# Altium project LPF-8-Order.PrjPcb
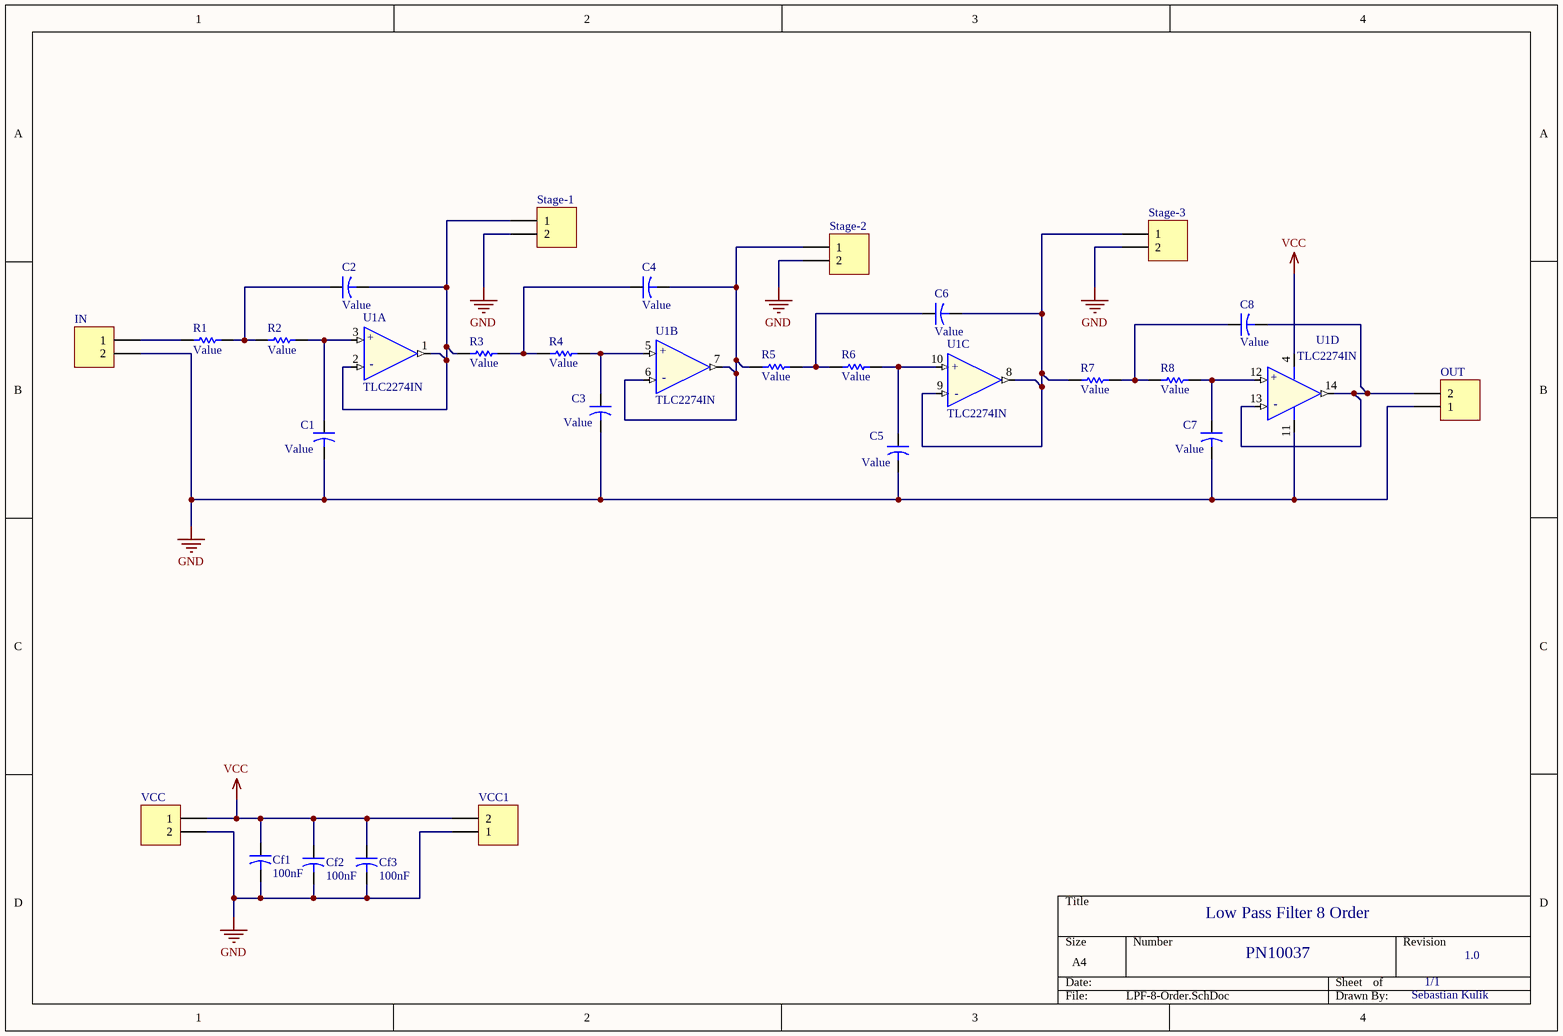
[diagram p0: LPF-8-Order.SchDoc]
1 sheet, 27 parts. Net scope: global (net labels, ports and power ports of the same name join across sheets).
Board file: LPF-8-Order.PcbDoc

## Sheet LPF-8-Order.SchDoc
size A4

### Parts
C1  Capacitor-Dummy-THT  [Dummy-10mm]  (value not drawn)
C2  Capacitor-Dummy-THT  [Dummy-10mm]  (value not drawn)
C3  Capacitor-Dummy-THT  [Dummy-10mm]  (value not drawn)
C4  Capacitor-Dummy-THT  [Dummy-10mm]  (value not drawn)
C5  Capacitor-Dummy-THT  [Dummy-10mm]  (value not drawn)
C6  Capacitor-Dummy-THT  [Dummy-10mm]  (value not drawn)
C7  Capacitor-Dummy-THT  [Dummy-10mm]  (value not drawn)
C8  Capacitor-Dummy-THT  [Dummy-10mm]  (value not drawn)
Cf1  value 100nF  [Dummy-10mm]  (hidden comment: Capacitor-Dummy-THT)
Cf2  value 100nF  [Dummy-10mm]  (hidden comment: Capacitor-Dummy-THT)
Cf3  value 100nF  [Dummy-10mm]  (hidden comment: Capacitor-Dummy-THT)
IN  PHOENIX_1715721  [Phoenix-2-5_08]  (value not drawn)
OUT  PHOENIX_1715721  [Phoenix-2-5_08]  (value not drawn)
R1  Resistor-Dummy-THT  [Dummy-10mm]  (value not drawn)
R2  Resistor-Dummy-THT  [Dummy-10mm]  (value not drawn)
R3  Resistor-Dummy-THT  [Dummy-10mm]  (value not drawn)
R4  Resistor-Dummy-THT  [Dummy-10mm]  (value not drawn)
R5  Resistor-Dummy-THT  [Dummy-10mm]  (value not drawn)
R6  Resistor-Dummy-THT  [Dummy-10mm]  (value not drawn)
R7  Resistor-Dummy-THT  [Dummy-10mm]  (value not drawn)
R8  Resistor-Dummy-THT  [Dummy-10mm]  (value not drawn)
Stage-1  Plug_2_90_2.54  [HDR1X2]  (value not drawn)
Stage-2  Plug_2_90_2.54  [HDR1X2]  (value not drawn)
Stage-3  Plug_2_90_2.54  [HDR1X2]  (value not drawn)
U1  TLC2274IN  [DIP-14]  (parts A,B,C,D of 4)
VCC  PHOENIX_1715721  [Phoenix-2-5_08]  (value not drawn)
VCC1  PHOENIX_1715721  [Phoenix-2-5_08]  (value not drawn)

### Nets
GND: C1.2 C3.2 C5.2 C7.2 Cf1.2 Cf2.2 Cf3.2 IN.2 OUT.1 Stage-1.2 Stage-2.2 Stage-3.2 U1.11(V-) VCC.2 VCC1.1
VCC: Cf1.1 Cf2.1 Cf3.1 U1.4(V+) VCC.1 VCC1.2
NetC1_1: C1.1 R2.2 U1.3(IN-)
NetC2_1: C2.1 R1.2 R2.1
NetC2_2: C2.2 R3.1 Stage-1.1 U1.1(OUT) U1.2(IN+)
NetC3_1: C3.1 R4.2 U1.5(IN-)
NetC4_1: C4.1 R3.2 R4.1
NetC4_2: C4.2 R5.1 Stage-2.1 U1.6(IN+) U1.7(OUT)
NetC5_1: C5.1 R6.2 U1.10(IN-)
NetC6_1: C6.1 R5.2 R6.1
NetC6_2: C6.2 R7.1 Stage-3.1 U1.8(OUT) U1.9(IN+)
NetC7_1: C7.1 R8.2 U1.12(IN-)
NetC8_1: C8.1 R7.2 R8.1
NetC8_2: C8.2 OUT.2 U1.13(IN+) U1.14(OUT)
NetIN_1: IN.1 R1.1

### Notes on the sheet
- Low Pass Filter 8 Order
- PN10037
- 1/1
- 1.0
- Sebastian Kulik
- (in symbol TLC2274IN, part A) +; -
- (in symbol TLC2274IN, part B) +; -
- (in symbol TLC2274IN, part C) +; -
- (in symbol TLC2274IN, part D) +; -

### Library data of the parts
Cf1-Cf3 = Capacitor-Dummy-THT: Deliverer PartNr: 537-3707; Deliverer: RS; Published: 08.12.2015; Part Description: Capacitor-Dummy-THT; Publisher: Sebastian Kulik; PackageDescription: -; Manufacturer: -; Manufacturer PartNr: -; TDE-PN: -
IN OUT VCC VCC1 = 2Pol_1715721: Phoenix, 2 pol, 5.08mm, 22A, 715721; Deliverer PartNr: 193-0564; Deliverer: RS; TDE-PN: CON0008; LatestRevisionDate: 02.05.2014; LatestRevisionNote: Re-released for DXP Platform.; Publisher: Sebastian Kulik; Manufacturer PartNr: 1715721; Manufacturer: Phoenix; PackageDescription: Phoenix-2-5_08
Stage-1-Stage-3 = Plug_2_90_2.54: Plug, 2-Pin; Manufacturer PartNr: 61300211021; Manufacturer: WE; Deliverer PartNr: 2356176; Deliverer: Farnell; TDE-PN: CON0010; LatestRevisionDate: 14.05.2014; LatestRevisionNote: Re-released for DXP Platform.; Publisher: Sebastian Kulik
U1 = TLC2274IN: Reel to Reel  quad OP; Deliverer PartNr: 331-2182; Manufacturer: TI; Deliverer: RS; TDE-PN: IC0072; Published: 28.03.2014; PackageDescription: TSSOP8; Publisher: Sebastian Kulik; Manufacturer PartNr: TLC2274IN
C1-C8 = Capacitor-Dummy-THT: Published: 08.12.2015; Part Description: Capacitor-Dummy-THT; Publisher: Sebastian Kulik; PackageDescription: -; Deliverer: -; Deliverer PartNr: -; Manufacturer: -; Manufacturer PartNr: -; TDE-PN: -; Value: Value
R1-R8 = Resistor-Dummy-THT: Published: 08.12.2015; Publisher: Sebastian Kulik; PackageDescription: -; Manufacturer: -; Manufacturer PartNr: -; TDE-PN: -; Deliverer PartNr: -; Deliverer: -; Part Desicription: Resistor-Dummy-THT; Value: Value